# Altium schematic sheet TLV3501.SchDoc
size A4
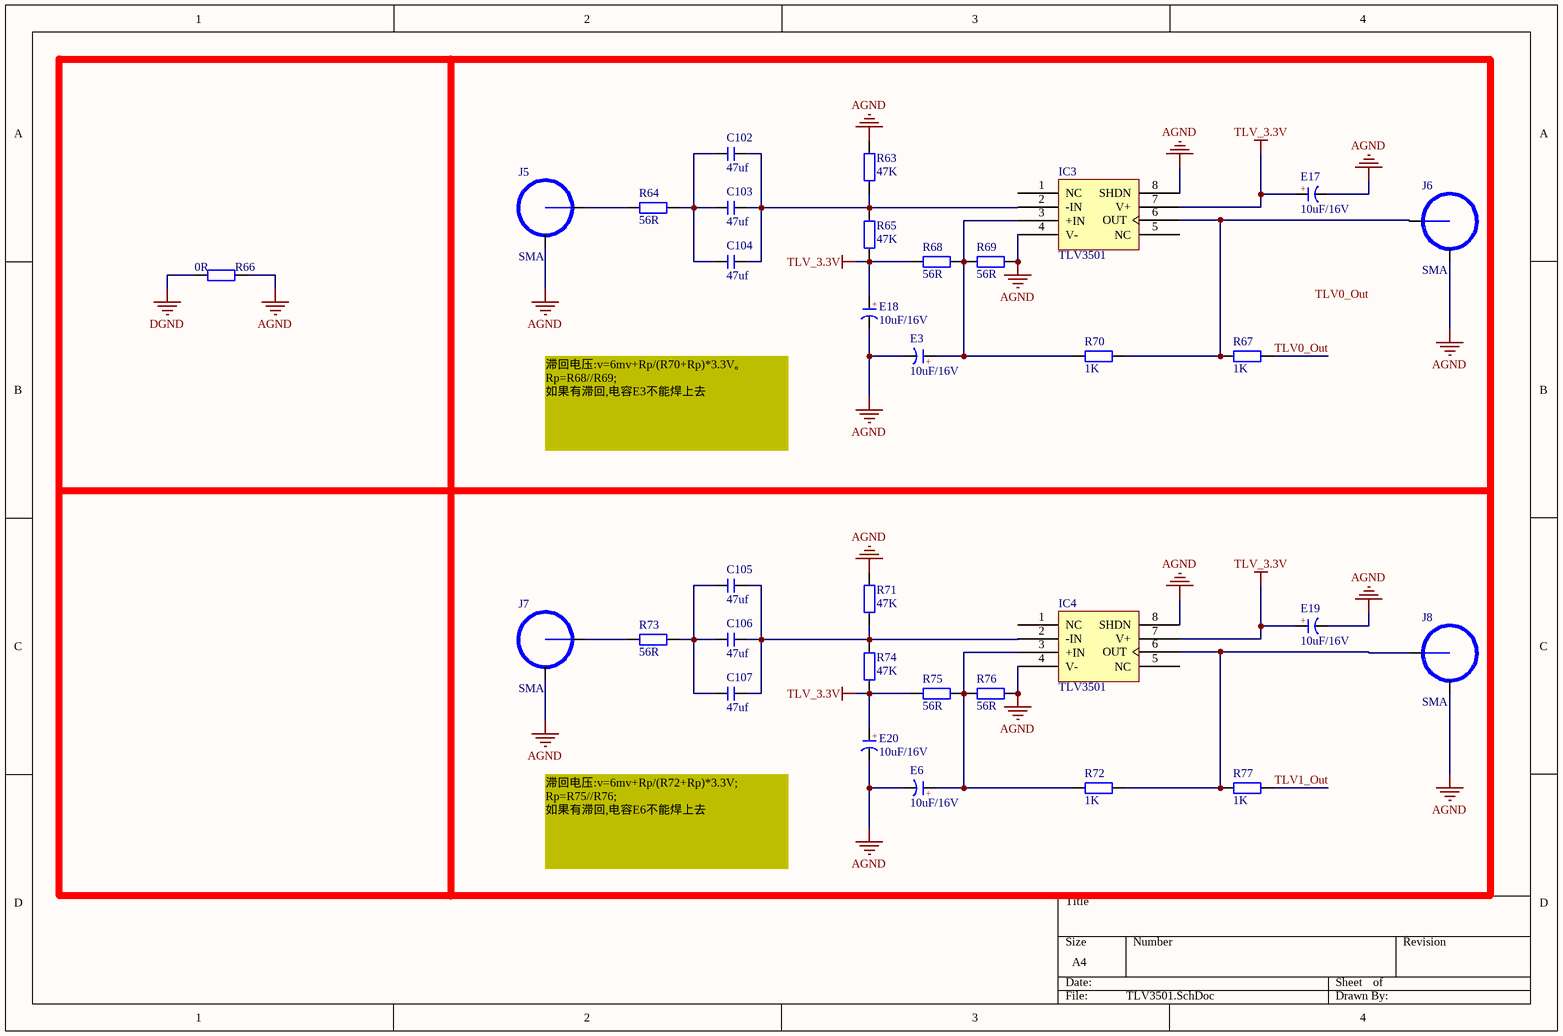
[diagram p0: TLV3501.SchDoc]

## Parts
C102  47uf  [C 0805_M]
C103  47uf  [C 0805_M]
C104  47uf  [C 0805_M]
C105  47uf  [C 0805_M]
C106  47uf  [C 0805_M]
C107  47uf  [C 0805_M]
E3  10uF/16V  [C 1210_M]
E6  10uF/16V  [C 1210_M]
E17  10uF/16V  [C 1210_M]
E18  10uF/16V  [C 1210_M]
E19  10uF/16V  [C 1210_M]
E20  10uF/16V  [C 1210_M]
IC3  TLV3501  [SOP8_M]
IC4  TLV3501  [SOP8_M]
J5  SMA  [SMA_FR]
J6  SMA  [SMA_FR]
J7  SMA  [SMA_FR]
J8  SMA  [SMA_FR]
R63  47K  [R 0805_M]
R64  56R  [R 0805_M]
R65  47K  [R 0805_M]
R66  0R  [R 0805_M]
R67  1K  [R 0805_L]
R68  56R  [R 0805_M]
R69  56R  [R 0805_M]
R70  1K  [R 0805_M]
R71  47K  [R 0805_M]
R72  1K  [R 0805_M]
R73  56R  [R 0805_M]
R74  47K  [R 0805_M]
R75  56R  [R 0805_M]
R76  56R  [R 0805_M]
R77  1K  [R 0805_L]

## Nets
AGND: E3.2(K) E6.2(K) E17.2(K) E18.2(K) E19.2(K) E20.2(K) IC3.4(V-) IC3.8(SHDN) IC4.4(V-) IC4.8(SHDN) J5.2 J6.2 J7.2 J8.2 R63.2 R66.2 R69.1 R71.2 R76.1
DGND: R66.1
TLV_3.3V: E17.1(A) E18.1(A) E19.1(A) E20.1(A) IC3.7(V+) IC4.7(V+) R65.1 R68.2 R74.1 R75.2
TLV0_Out: R67.2
TLV1_Out: R77.2
NetC102_1: C102.1 C103.1 C104.1 R64.1
NetC102_2: C102.2 C103.2 C104.2 IC3.2(-IN) R63.1 R65.2
NetC105_1: C105.1 C106.1 C107.1 R73.1
NetC105_2: C105.2 C106.2 C107.2 IC4.2(-IN) R71.1 R74.2
NetE3_1: E3.1(A) IC3.3(+IN) R68.1 R69.2 R70.2
NetE6_1: E6.1(A) IC4.3(+IN) R72.2 R75.1 R76.2
NetIC3_6: IC3.6(OUT) J6.1 R67.1 R70.1
NetIC4_6: IC4.6(OUT) J8.1 R72.1 R77.1
NetJ5_1: J5.1 R64.2
NetJ7_1: J7.1 R73.2

Not connected (* = marked no-connect by the designer): IC3 1(NC) 5(NC); IC4 1(NC) 5(NC)

## Notes on the sheet
- 滞回电压:v=6mv+Rp/(R70+Rp)*3.3V。
  Rp=R68//R69;
  如果有滞回,电容E3不能焊上去
- 滞回电压:v=6mv+Rp/(R72+Rp)*3.3V;
  Rp=R75//R76;
  如果有滞回,电容E6不能焊上去
- Labels drawn without touching a wire or pin: TLV0_Out
- (in symbol C-CAP) +

## Library data of the parts
C102-C107 = C: 无极性贴片电容; 版权归属: 源创客; BOM名称: 无极性贴片电容; 学习资源: www.ooocke.com
E3 E6 E17-E20 = C-CAP: 直插电解电容; 版权归属: 源创客; BOM名称: 直插电解电容; 学习资源: www.ooocke.com
IC3 IC4 = 24Cxx: 外置EEPROM; 版权归属: 源创客; BOM名称: 外置EEPROM; 学习资源: www.ooocke.com
R63-R77 = R: 贴片电阻; 版权归属: 源创客; BOM名称: 贴片电阻; 学习资源: www.ooocke.com